# Altium project PumpSystem.PrjPCB (part 1 of 8)
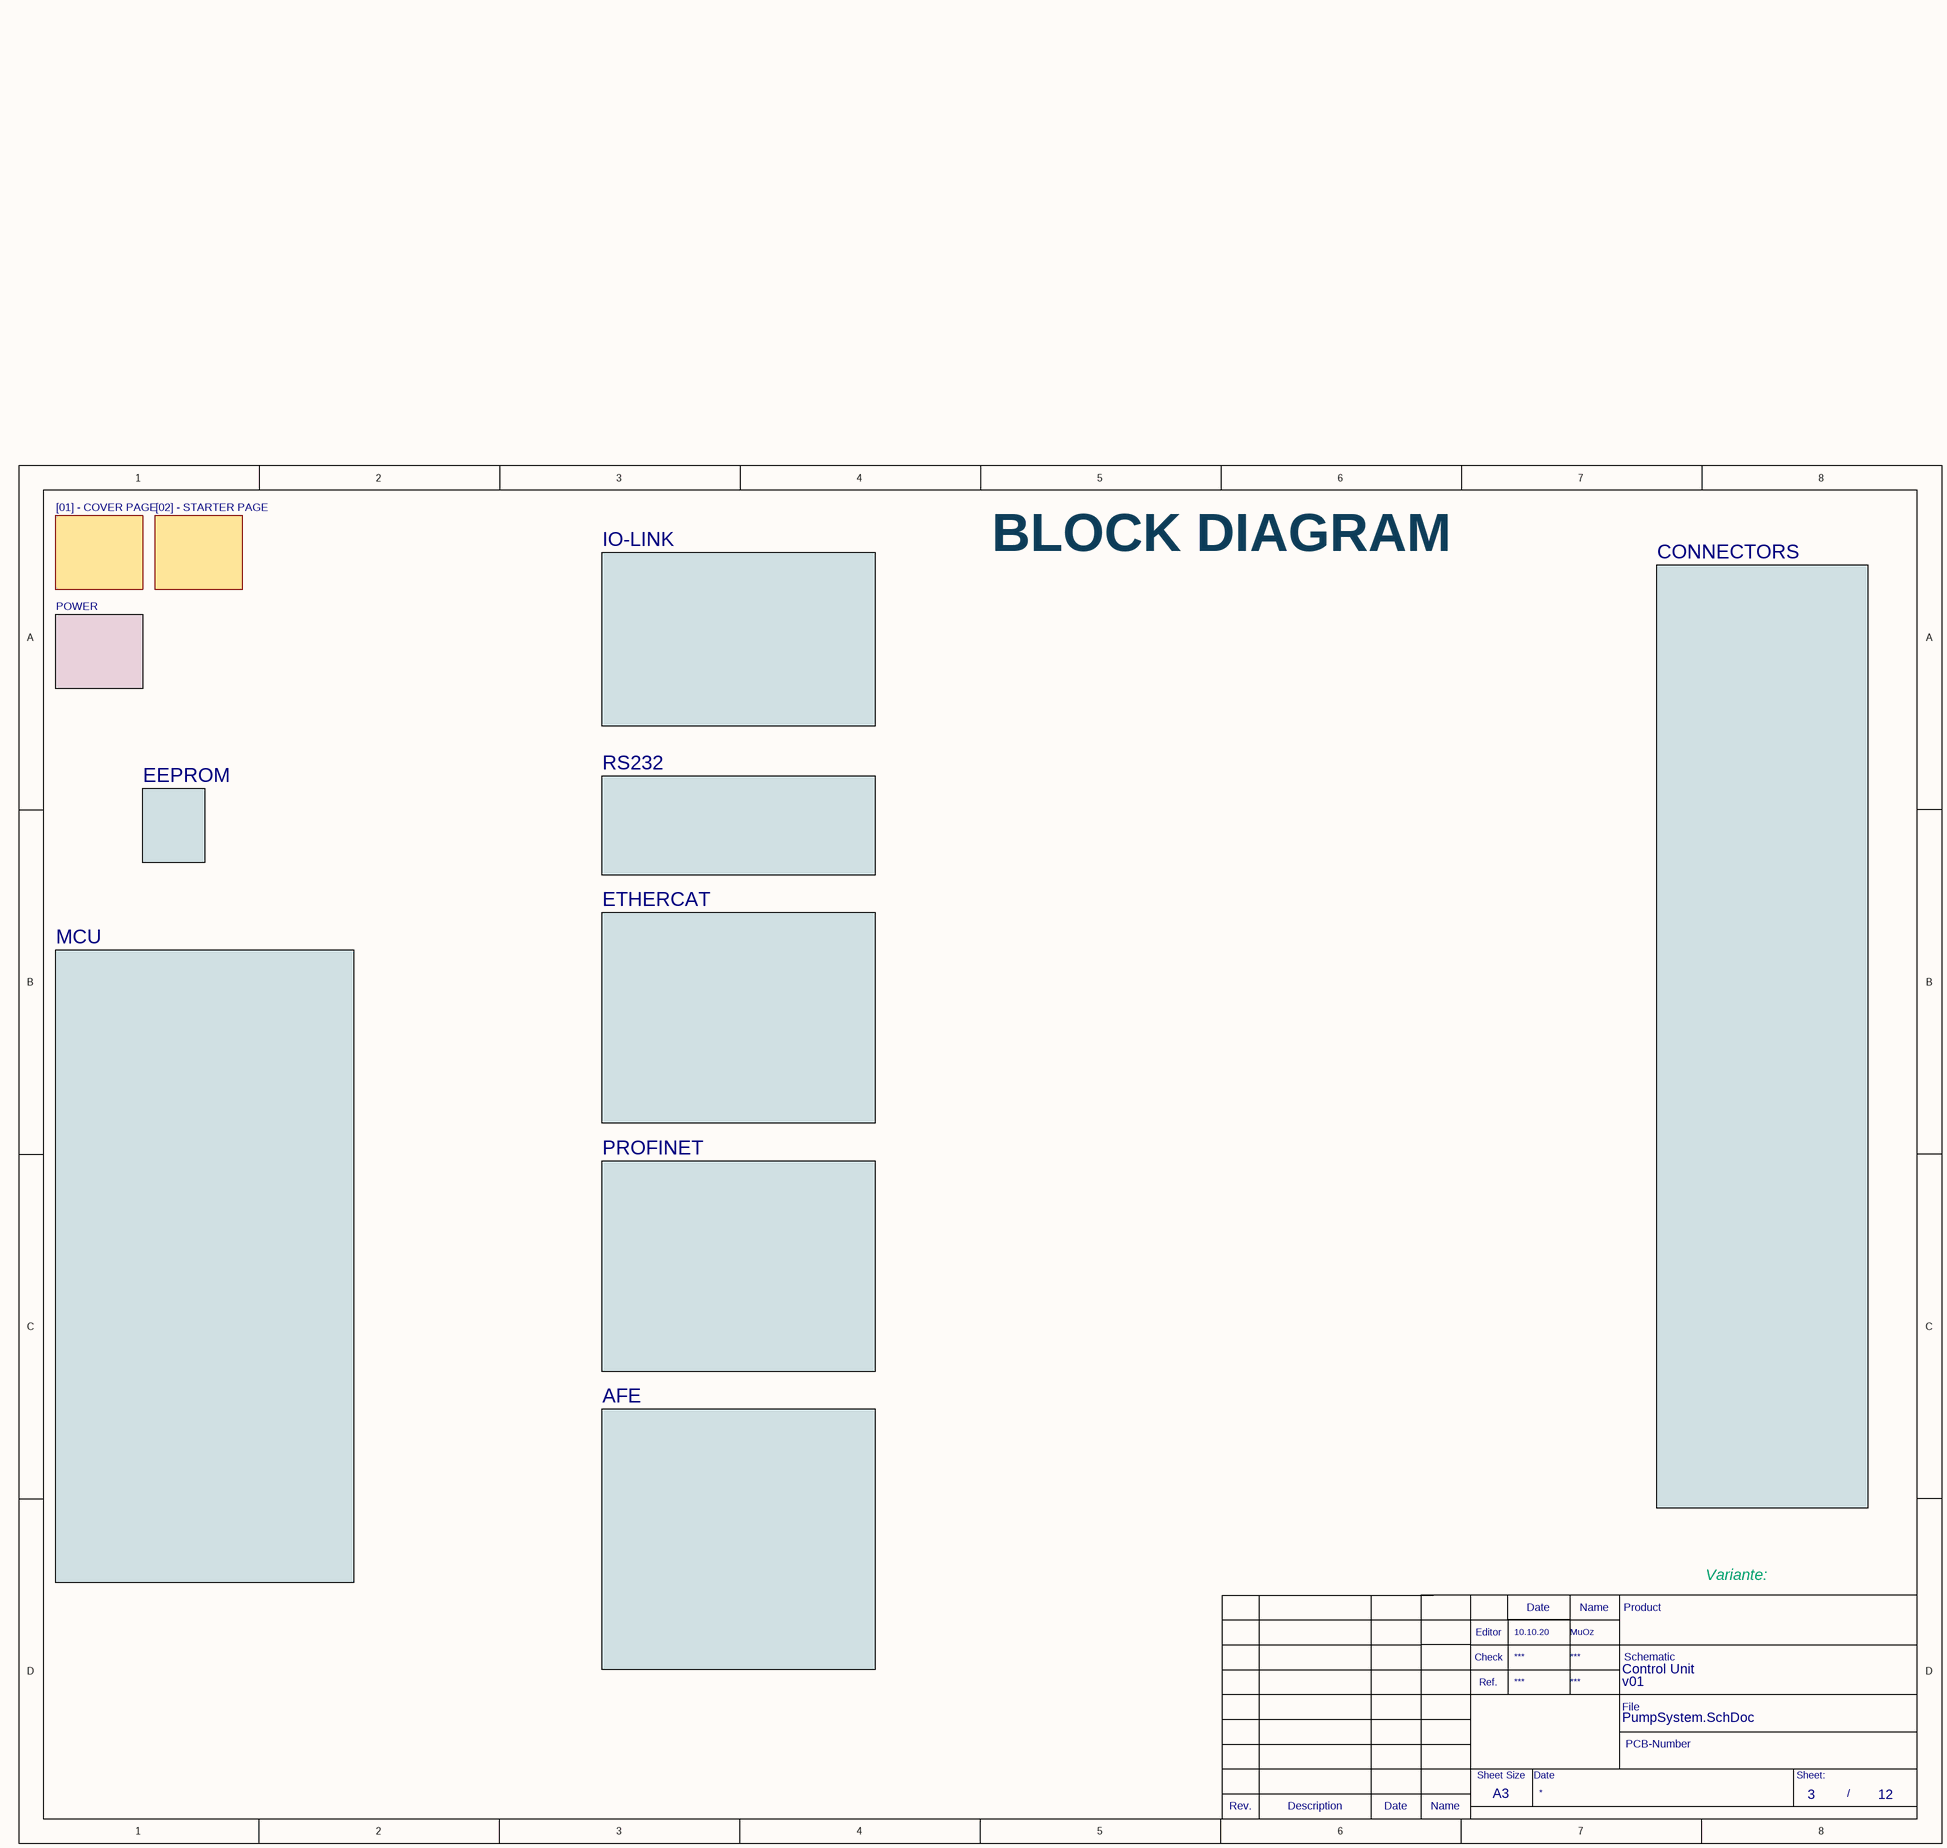
[diagram p0: PumpSystem.SchDoc]
ApprovedBy_PRO: ***; ApprovedDate_PRO: ***; Author_PRO: MuOz; CheckedBy_PRO: ***; CheckedDate_PRO: ***; Date_PRO: 10.10.20; Title1_PRO: Control Unit; Title2_PRO: v01
12 sheets, 375 parts. Net scope: flat (ports and power ports of the same name join across sheets).
Board file: PumpSystem.PcbDoc
Sheets:
  PumpSystem.SchDoc
    [01] - COVER PAGE = [01] - COVER PAGE.SchDoc
    [02] - STARTER PAGE = [02] - STARTER PAGE.SchDoc
    MCU = [03] - MCU.SchDoc
    ETHERCAT = [04] - ETHERCAT.SchDoc
    PROFINET = [05] - PROFINET.SchDoc
    POWER = [06] - POWER.SchDoc
    RS232 = [07] - RS232.SchDoc
    IO-LINK = [08] - IO-LINK.SchDoc
    AFE = [09] - AFE.SchDoc
    CONNECTORS = [10] - CONNECTORs.SchDoc
    EEPROM = [11] - EEPROM.SchDoc

## Sheet PumpSystem.SchDoc
size A3; CompanyName: FEDEVEL; Organization: FEDEVEL; DocumentNumber: 3; Revision: V1I1; SheetNumber: 3; SheetTotal: 12; PageSetup: Record=PageOptions|CenterHorizontal=True|CenterVertical=True|PrintScale=1.07|XCorrection=1.00|YCorrection=1.00|PrintKind=1|BorderSize=5000000|LeftOffset=0|BottomOffset=0|Orientation=2|PaperLength=1000|PaperWidth=1000|Scale=100|PaperSource=7|PrintQuality=600|MediaType=1|DitherType=10|PaperKind=A3|PrintScaleMode=1; ProjectName: KDS C6A816x Module

### Sub-sheets
[01] - COVER PAGE = [01] - COVER PAGE.SchDoc: no entries
[02] - STARTER PAGE = [02] - STARTER PAGE.SchDoc: no entries
AFE = [09] - AFE.SchDoc: no entries
CONNECTORS = [10] - CONNECTORs.SchDoc: no entries
EEPROM = [11] - EEPROM.SchDoc: no entries
ETHERCAT = [04] - ETHERCAT.SchDoc: no entries
IO-LINK = [08] - IO-LINK.SchDoc: no entries
MCU = [03] - MCU.SchDoc: no entries
POWER = [06] - POWER.SchDoc: no entries
PROFINET = [05] - PROFINET.SchDoc: no entries
RS232 = [07] - RS232.SchDoc: no entries

### Notes on the sheet
- BLOCK DIAGRAM
- Date
- Name
- Product
- Variante:
- Editor
- Check
- Ref.
- Schematic
- File
- PCB-Number
- Rev.
- Description
- Sheet Size
- A3
- Sheet:
- /

## Sheet [01] - COVER PAGE.SchDoc
size A3; DocumentNumber: 1; SheetNumber: 1; SheetTotal: 12
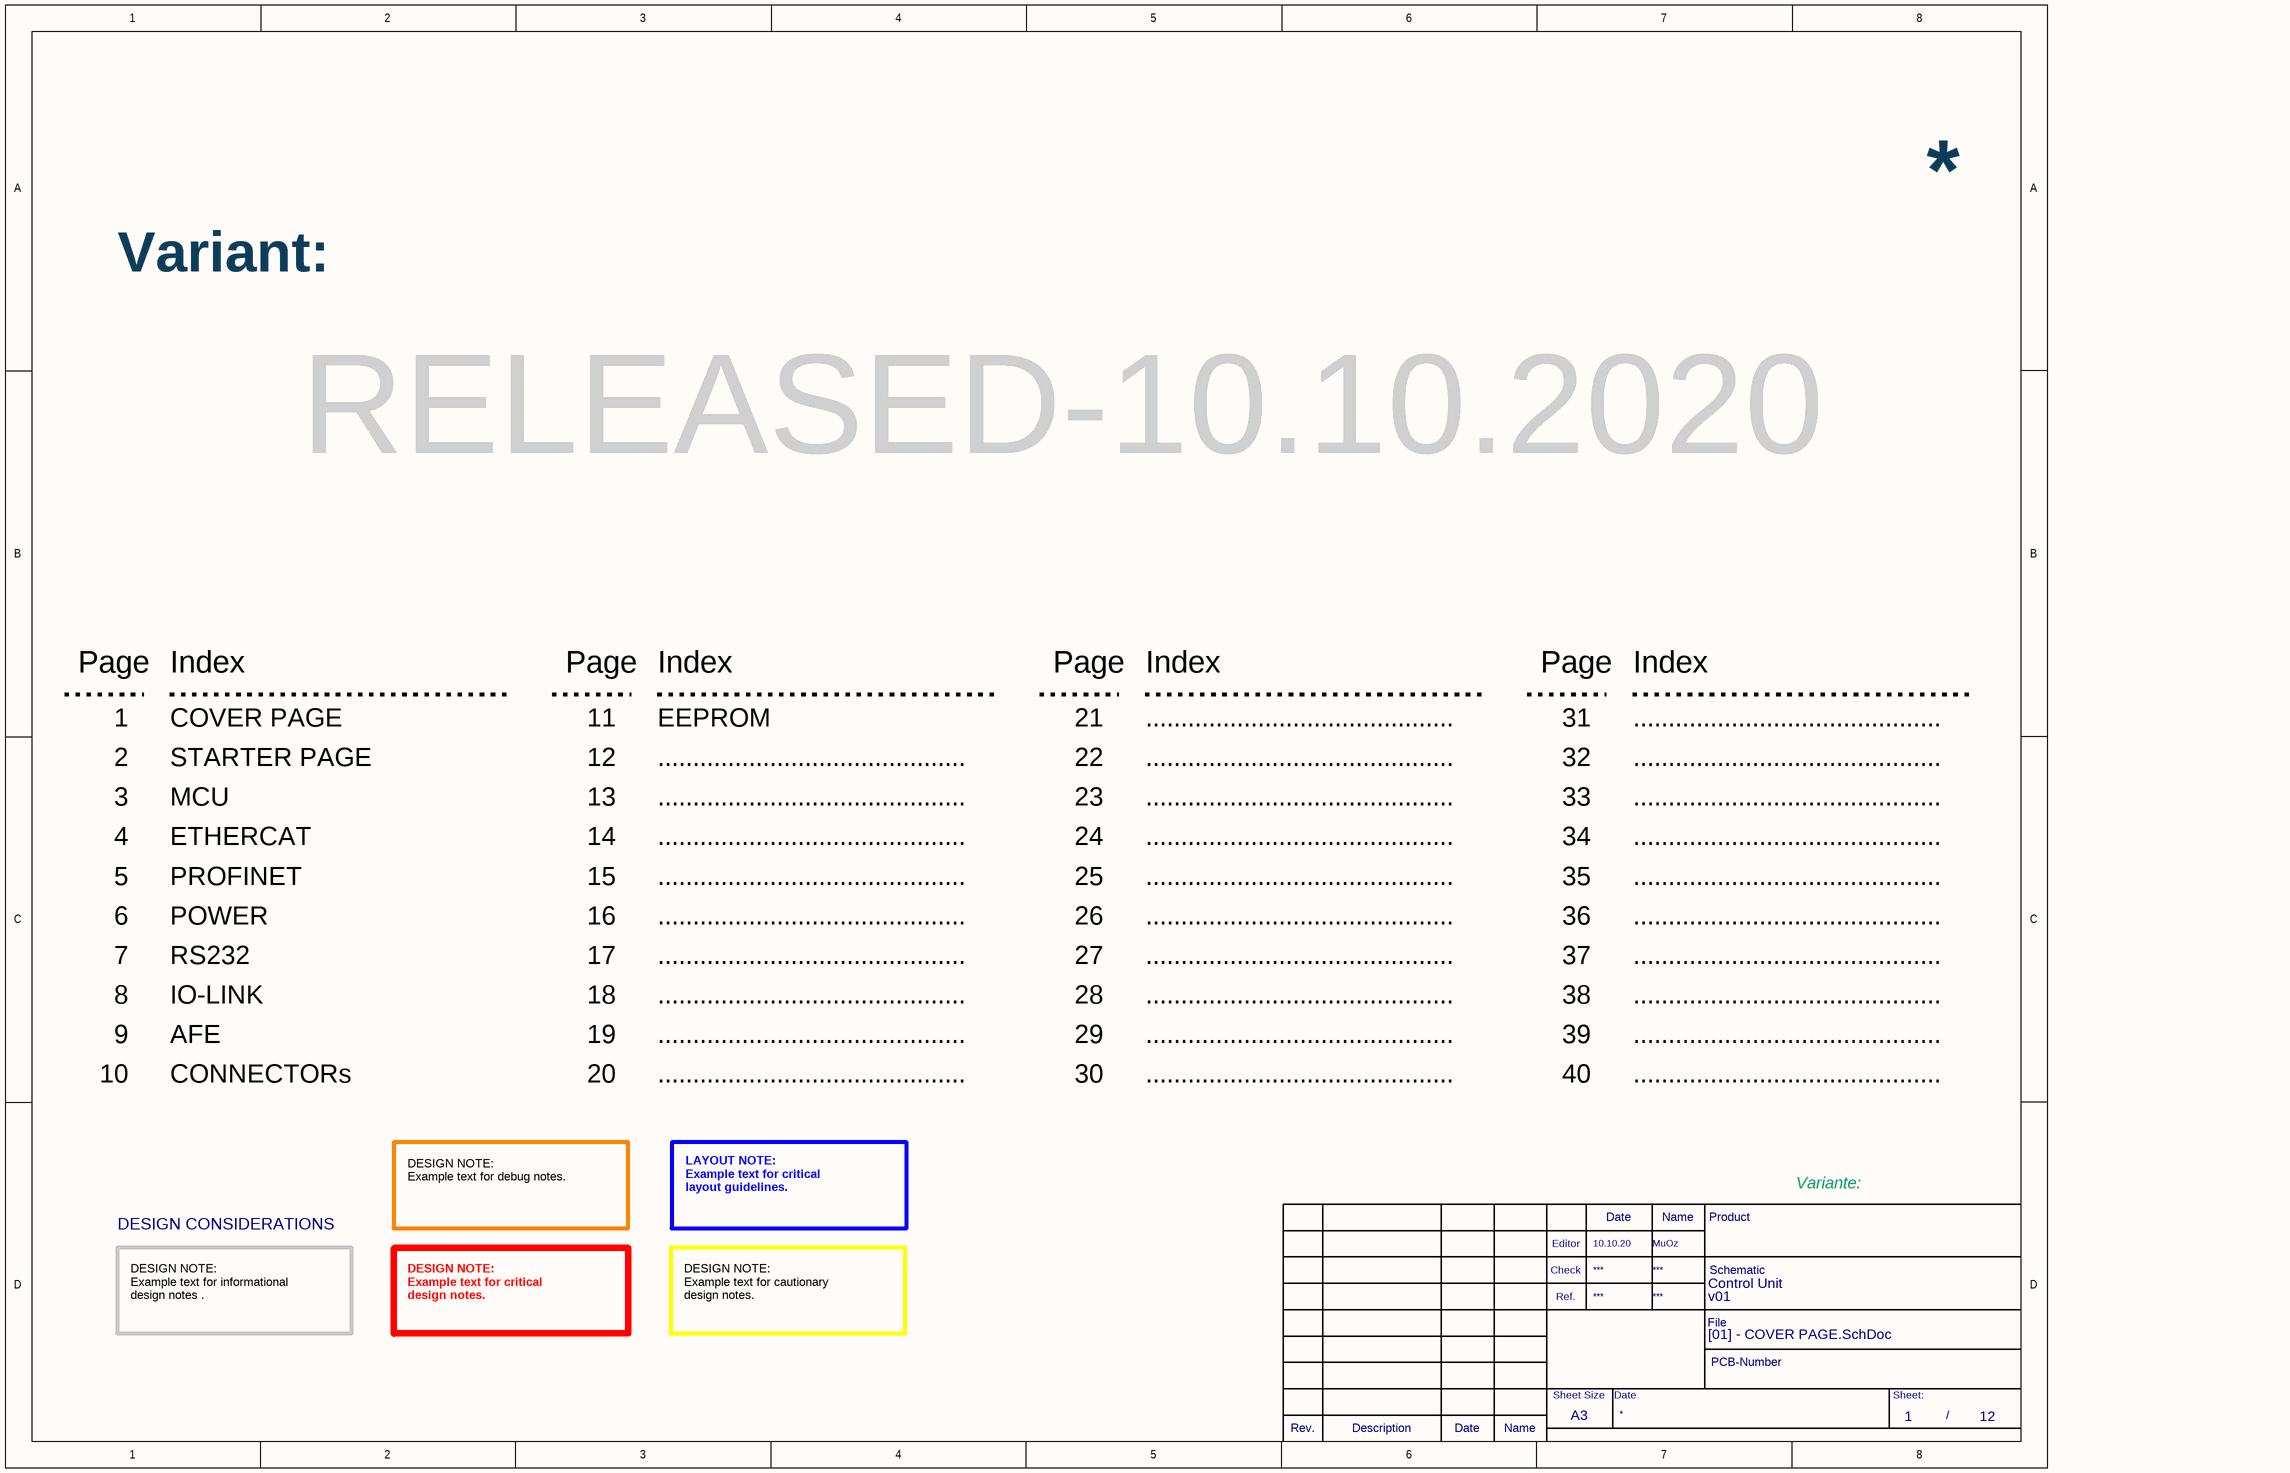
[diagram p1: [01] - COVER PAGE.SchDoc]

### Notes on the sheet
- Variant:
- RELEASED-10.10.2020
- Page
- Index
- 1
- 2
- COVER PAGE
- STARTER PAGE
- 11
- 12
- EEPROM
- ............................................
- 21
- 22
- 31
- 32
- 3
- MCU
- 13
- 23
- 33
- 4
- 5
- ETHERCAT
- PROFINET
- 14
- 15
- 24
- 25
- 34
- 35
- 6
- 7
- POWER
- RS232
- 16
- 17
- 26
- 27
- 36
- 37
- 8
- IO-LINK
- 18
- 28
- 38
- 9
- 10
- AFE
- CONNECTORs
- 19
- 20
- 29
- 30
- 39
- 40
- DESIGN CONSIDERATIONS
- DESIGN NOTE:
  Example text for debug notes.
- LAYOUT NOTE:
  Example text for critical
  layout guidelines.
- DESIGN NOTE:
  Example text for informational
  design notes .
- DESIGN NOTE:
  Example text for critical
  design notes.
- DESIGN NOTE:
  Example text for cautionary
  design notes.
- Date
- Name
- Product
- Variante:
- Editor
- Check
- Ref.
- Schematic
- File
- PCB-Number
- Rev.
- Description
- Sheet Size
- A3
- Sheet:
- /

## Sheet [02] - STARTER PAGE.SchDoc
size A3; DocumentNumber: 2; SheetNumber: 2; SheetTotal: 12
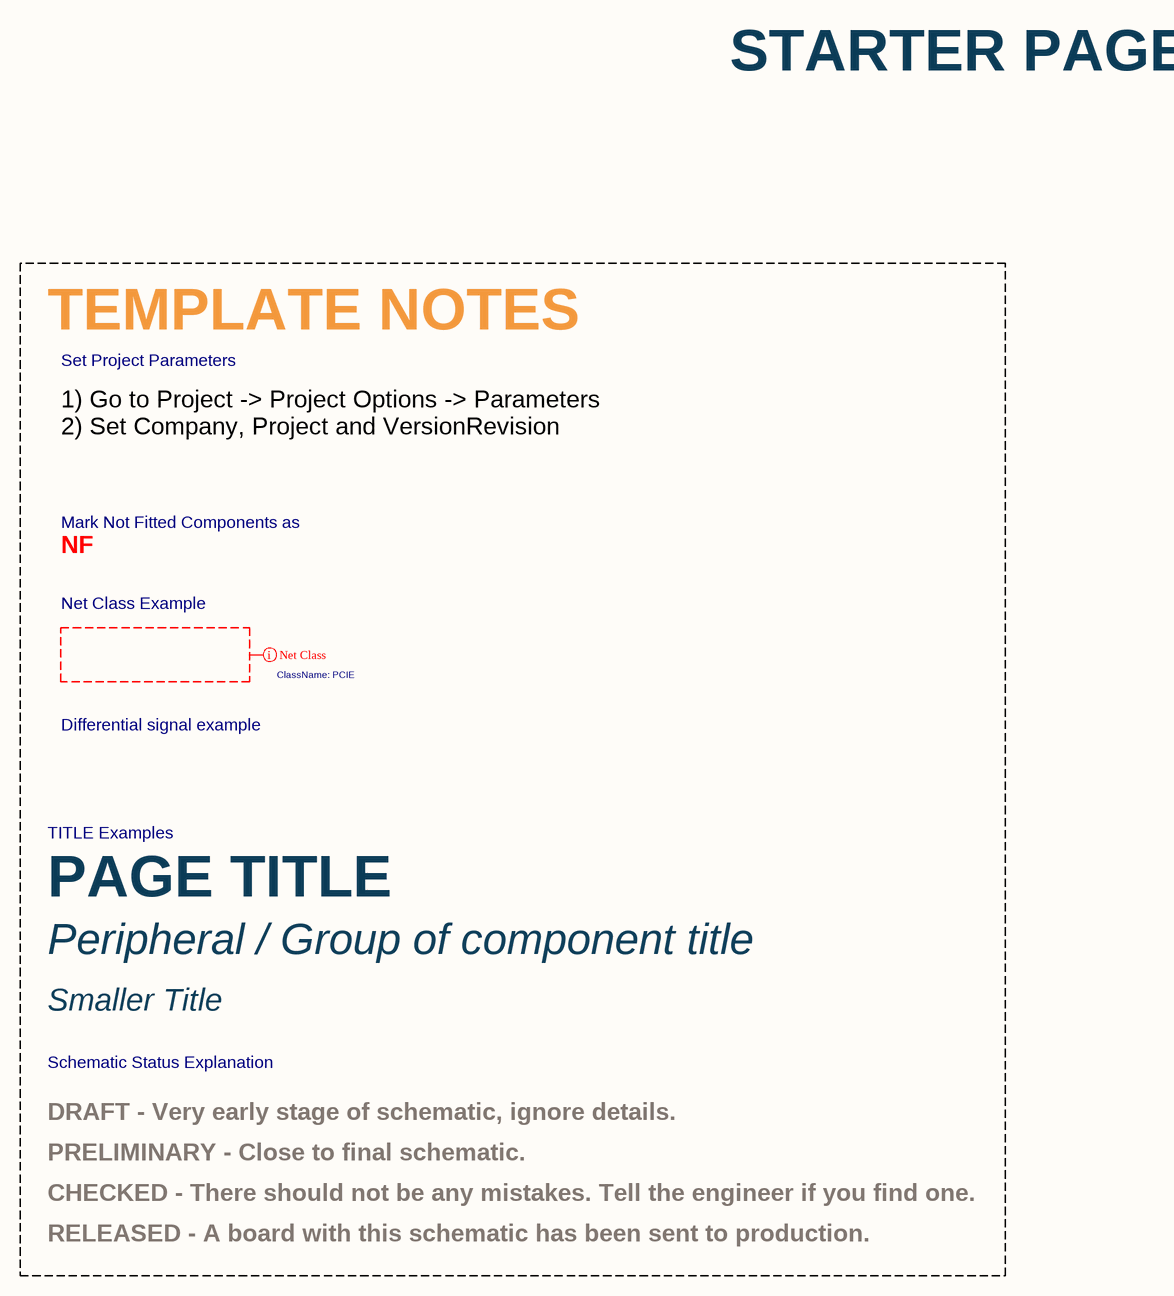
[diagram p2: [02] - STARTER PAGE.SchDoc]

### Layout directives
net class PCIE: (no net found under the mark)

### Notes on the sheet
- STARTER PAGE
- TEMPLATE NOTES
- Set Project Parameters
- 1) Go to Project -> Project Options -> Parameters
  2) Set Company, Project and VersionRevision
- NF
- Mark Not Fitted Components as
- Net Class Example
- Differential signal example
- TITLE Examples
- PAGE TITLE
- Peripheral / Group of component title
- Smaller Title
- Schematic Status Explanation
- DRAFT - Very early stage of schematic, ignore details.
- PRELIMINARY - Close to final schematic.
- RELEASED - A board with this schematic has been sent to production.
- CHECKED - There should not be any mistakes. Tell the engineer if you find one.
- Date
- Name
- Product
- Variante:
- Editor
- Check
- Ref.
- Schematic
- File
- PCB-Number
- Rev.
- Description
- Sheet Size
- A3
- Sheet:
- /

## Sheet [03] - MCU.SchDoc
size A3; DocumentNumber: 4; SheetNumber: 4; SheetTotal: 12
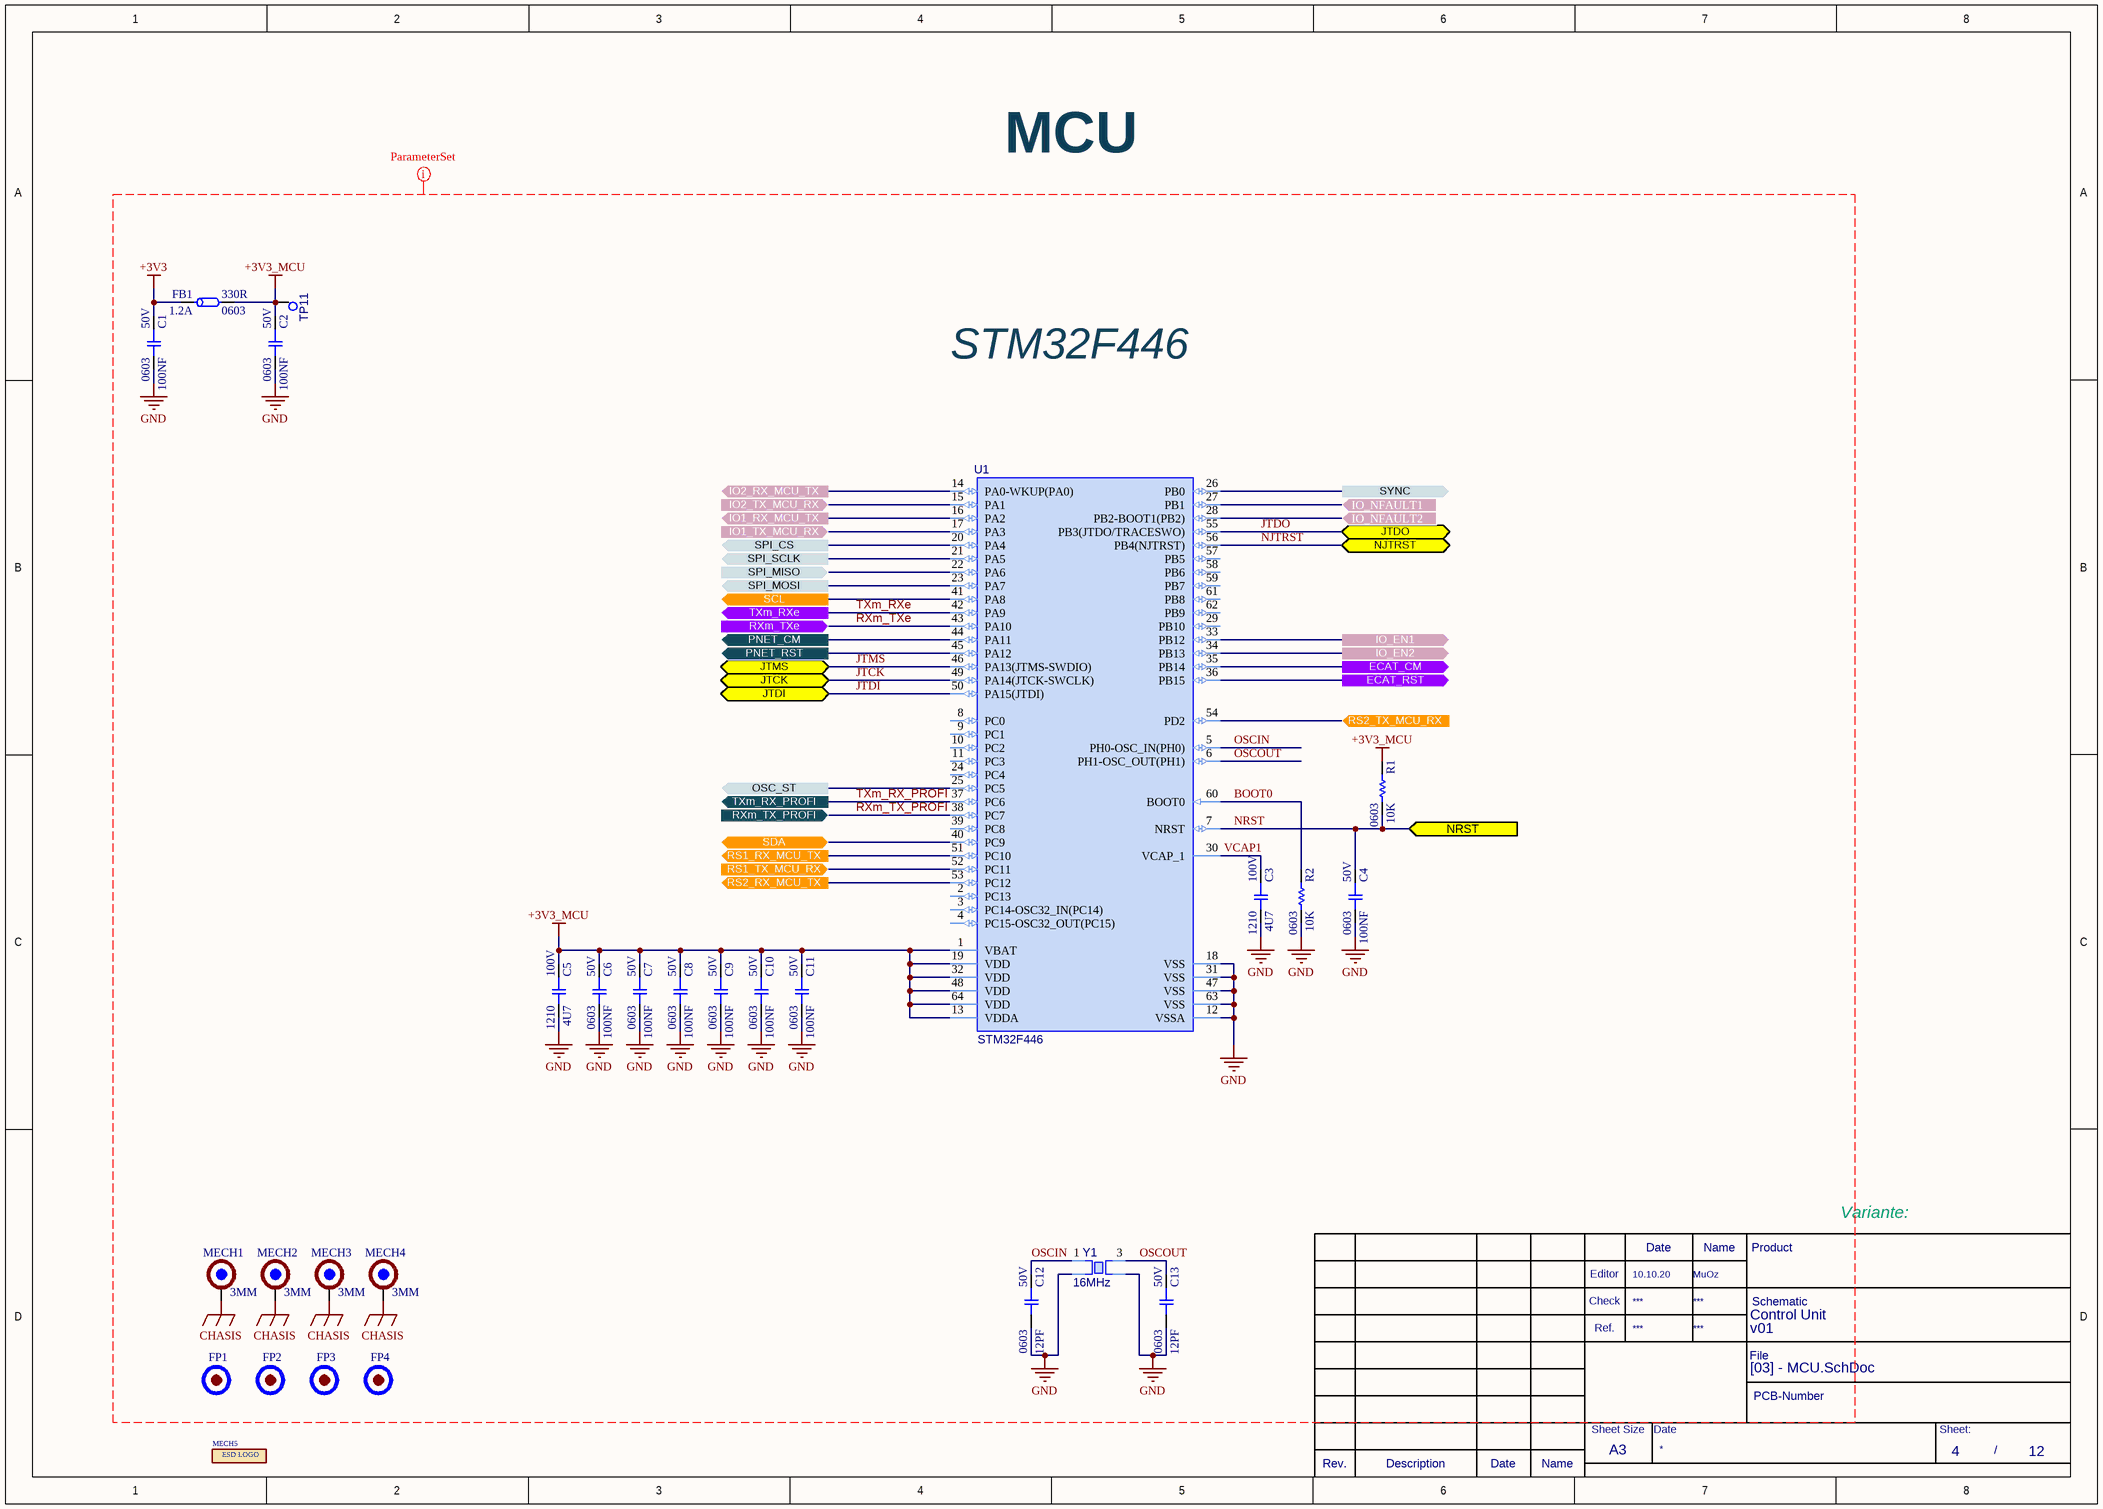
[diagram p3: [03] - MCU.SchDoc]

### Parts
C1  100NF  Voltage Rating: 50V  Case Code (Imperial): 0603  [C-0603]
C2  100NF  Voltage Rating: 50V  Case Code (Imperial): 0603  [C-0603]
C3  4U7  Case/Package: 1210  Voltage Rating: 100V  [C-1210]
C4  100NF  Voltage Rating: 50V  Case Code (Imperial): 0603  [C-0603]
C5  4U7  Case/Package: 1210  Voltage Rating: 100V  [C-1210]
C6  100NF  Voltage Rating: 50V  Case Code (Imperial): 0603  [C-0603]
C7  100NF  Voltage Rating: 50V  Case Code (Imperial): 0603  [C-0603]
C8  100NF  Voltage Rating: 50V  Case Code (Imperial): 0603  [C-0603]
C9  100NF  Voltage Rating: 50V  Case Code (Imperial): 0603  [C-0603]
C10  100NF  Voltage Rating: 50V  Case Code (Imperial): 0603  [C-0603]
C11  100NF  Voltage Rating: 50V  Case Code (Imperial): 0603  [C-0603]
C12  12PF  Case Code (Imperial): 0603  Voltage: 50V  [C-0603]
C13  12PF  Case Code (Imperial): 0603  Voltage: 50V  [C-0603]
FB1  330R  Case/Package: 0603  DC Current: 1.2A  [FB-0603]
FP1  MECH-Fiducial  [MECH-Fiducial]  (value not drawn)  (no BOM)
FP2  MECH-Fiducial  [MECH-Fiducial]  (value not drawn)  (no BOM)
FP3  MECH-Fiducial  [MECH-Fiducial]  (value not drawn)  (no BOM)
FP4  MECH-Fiducial  [MECH-Fiducial]  (value not drawn)  (no BOM)
MECH1  3MM  [MECH-3MM HOLE]  (no BOM)
MECH2  3MM  [MECH-3MM HOLE]  (no BOM)
MECH3  3MM  [MECH-3MM HOLE]  (no BOM)
MECH4  3MM  [MECH-3MM HOLE]  (no BOM)
MECH5  MECH-ESD-LOGO  [ESD_LOGO_4]  (value not drawn)  (no BOM)
R1  10K  Case Code (Imperial): 0603  [R-0603]
R2  10K  Case Code (Imperial): 0603  [R-0603]
TP11  MECH-TESTPOINT  [MECH-TESTPOINT]  (value not drawn)  (no BOM)
U1  STM32F446  [STM-LQFP64_M]
Y1  16MHz  [CRY-TSX-3225]

### Ports
ECAT_CM (out), ECAT_RST (out), IO1_RX_MCU_TX (out), IO1_TX_MCU_RX (in), IO2_RX_MCU_TX (out), IO2_TX_MCU_RX (in), IO_EN1 (out), IO_EN2 (out), IO_NFAULT1 (in), IO_NFAULT2 (in), JTCK (bidir), JTDI (bidir), JTDO (bidir), JTMS (bidir), NJTRST (bidir), NRST (in), OSC_ST (out), PNET_CM (out), PNET_RST (out), RS1_RX_MCU_TX (out), RS1_TX_MCU_RX (in), RS2_RX_MCU_TX (out), RS2_TX_MCU_RX (in), RXm_TX_PROFI (in), RXm_TXe (in), SCL (out), SDA (bidir), SPI_CS (out), SPI_MISO (in), SPI_MOSI (out), SPI_SCLK (out), SYNC (out), TXm_RX_PROFI (out), TXm_RXe (out)

### Nets
+3V3: C1.1 FB1.1
+3V3_MCU: C2.1 C5.1 C6.1 C7.1 C8.1 C9.1 C10.1 C11.1 FB1.2 R1.1 TP11.1 U1.1(VBAT) U1.13(VDDA) U1.19(VDD) U1.32(VDD) U1.48(VDD) U1.64(VDD)
CHASIS: MECH1.1 MECH2.1 MECH3.1 MECH4.1
GND: C1.2 C2.2 C3.2 C4.2 C5.2 C6.2 C7.2 C8.2 C9.2 C10.2 C11.2 C12.2 C13.2 R2.2 U1.12(VSSA) U1.18(VSS) U1.31(VSS) U1.47(VSS) U1.63(VSS) Y1.2 Y1.4
BOOT0: R2.1 U1.60(BOOT0)
ECAT_CM: U1.35(PB14) ; port ECAT_CM
ECAT_RST: U1.36(PB15) ; port ECAT_RST
IO1_RX: U1.16(PA2) ; port IO1_RX_MCU_TX
IO1_TX: U1.17(PA3) ; port IO1_TX_MCU_RX
IO2_RX: U1.14(PA0-WKUP(PA0)) ; port IO2_RX_MCU_TX
IO2_TX: U1.15(PA1) ; port IO2_TX_MCU_RX
IO_EN1: U1.33(PB12) ; port IO_EN1
IO_EN2: U1.34(PB13) ; port IO_EN2
IO_NFAULT1: U1.27(PB1) ; port IO_NFAULT1
IO_NFAULT2: U1.28(PB2-BOOT1(PB2)) ; port IO_NFAULT2
JTCK: U1.49(PA14(JTCK-SWCLK)) ; port JTCK
JTDI: U1.50(PA15(JTDI)) ; port JTDI
JTDO: U1.55(PB3(JTDO/TRACESWO)) ; port JTDO
JTMS: U1.46(PA13(JTMS-SWDIO)) ; port JTMS
NJTRST: U1.56(PB4(NJTRST)) ; port NJTRST
NRST: C4.1 R1.2 U1.7(NRST) ; port NRST
OSC_ST: U1.25(PC5) ; port OSC_ST
OSCIN: C12.1 U1.5(PH0-OSC_IN(PH0)) Y1.1
OSCOUT: C13.1 U1.6(PH1-OSC_OUT(PH1)) Y1.3
PNET_CM: U1.44(PA11) ; port PNET_CM
PNET_RST: U1.45(PA12) ; port PNET_RST
RS1_RX_MCU_TX: U1.51(PC10) ; port RS1_RX_MCU_TX
RS1_TX_MCU_RX: U1.52(PC11) ; port RS1_TX_MCU_RX
RS2_RX_MCU_TX: U1.53(PC12) ; port RS2_RX_MCU_TX
RS2_TX_MCU_RX: U1.54(PD2) ; port RS2_TX_MCU_RX
RXm_TX_PROFI: U1.38(PC7) ; port RXm_TX_PROFI
RXm_TXe: U1.43(PA10) ; port RXm_TXe
SCL: U1.41(PA8) ; port SCL
SDA: U1.40(PC9) ; port SDA
SPI_CS: U1.20(PA4) ; port SPI_CS
SPI_MISO: U1.22(PA6) ; port SPI_MISO
SPI_MOSI: U1.23(PA7) ; port SPI_MOSI
SPI_SCLK: U1.21(PA5) ; port SPI_SCLK
SYNC: U1.26(PB0) ; port SYNC
TXm_RX_PROFI: U1.37(PC6) ; port TXm_RX_PROFI
TXm_RXe: U1.42(PA9) ; port TXm_RXe
VCAP1: C3.1 U1.30(VCAP_1)

Not connected (* = marked no-connect by the designer): U1 2(PC13) 3(PC14-OSC32_IN(PC14)) 4(PC15-OSC32_OUT(PC15)) 8(PC0) 9(PC1) 10(PC2) 11(PC3) 24(PC4) 29(PB10) 39(PC8) 57(PB5) 58(PB6) 59(PB7) 61(PB8) 62(PB9)

### Layout directives
net class MCU: +3V3, +3V3_MCU, BOOT0, CHASIS, GND, JTCK, JTDI, JTDO, JTMS, NJTRST, NRST, OSCIN, OSCOUT, RXm_TX_PROFI, RXm_TXe, TXm_RX_PROFI, TXm_RXe, VCAP1

### Notes on the sheet
- MCU
- STM32F446
- Date
- Name
- Product
- Variante:
- Editor
- Check
- Ref.
- Schematic
- File
- PCB-Number
- Rev.
- Description
- Sheet Size
- A3
- Sheet:
- /
- (in symbol MECH-ESD-LOGO) ESD LOGO

### Library data of the parts
C1 C2 C4 C6-C11 = C-100NF-0603: CAP CER 0.1UF 50V X7R 0603; Manufacturer: TDK; Manufacturer Part Number: C1608X7R1H104K080AA; Tolerance: 10%; Dielectric Material: Ceramic; .PCBCHK: USED; .Creator: F:TALI; Washability: OK; Temperature Coefficient: 30ppm/°C; Mount: Surface Mount; Case/Package: 0603; Case Code (Metric): 1608; Min Operating Temperature: -55°C; Max Operating Temperature: 125°C; Package Quantity: 1; Packaging: Tape and Reel; Features: Soft Termination; Length: 1.6mm; Width: 0.8mm; Thickness: 0.037inch; Lead Free: Lead Free; Capacitance: 100nF; Supplier 1: Digi-Key; Supplier Part Number 1: 445-1314-1-ND; Stock 1: 0; Pricing 1: 1=0.1, 10=0.057, 100=0.0254, 500=0.01812, 1000=0.01423 (USD); Contact Plating: Matte,Tin; Voltage Rating (DC): 50V; Dielectric: X7R; Termination: SMD/SMT; Voltage: 50V; Height: 0.8mm; Depth: 0.8mm; REACH SVHC: No SVHC; ComponentLink1URL: http://www.mouser.com/ds/2/400/lcc_commercial_general_en-837201.pdf; ComponentLink1Description: http://www.mouser.com/ds/2/400/lcc_commercial_general_en-837201.pdf; ComponentLink2URL: https://product.tdk.com/info/en/catalog/spec/mlccspec_commercial_general_midvoltage_en.pdf; ComponentLink2Description: https://product.tdk.com/info/en/catalog/spec/mlccspec_commercial_general_midvoltage_en.pdf; Supplier 2: Digi-Key; Supplier Part Number 2: 478-3540-6-ND; Stock 2: 40000; Pricing 2: 1=0.23, 10=0.161, 100=0.0756, 500=0.05304, 1000=0.0439 (USD); Number of Pins: 2; Radiation Hardening: No; ComponentLink3URL: http://uk.rs-online.com/webdocs/13d1/0900766b813d1103.pdf; ComponentLink3Description: http://uk.rs-online.com/webdocs/13d1/0900766b813d1103.pdf; ComponentLink4URL: http://www.tdk.co.jp/tefe02/e412_c.pdf; ComponentLink4Description: http://www.tdk.co.jp/tefe02/e412_c.pdf; ComponentLink5URL: http://www.farnell.com/datasheets/2291921.pdf; ComponentLink5Description: http://www.farnell.com/datasheets/2291921.pdf; ComponentLink6URL: http://www.farnell.com/datasheets/1744655.pdf; ComponentLink6Description: http://www.farnell.com/datasheets/1744655.pdf; ComponentLink7URL: http://catalogs.avx.com/SurfaceMount.pdf; ComponentLink7Description: http://catalogs.avx.com/SurfaceMount.pdf; ComponentLink8URL: http://www.farnell.com/datasheets/630895.pdf; ComponentLink8Description: http://www.farnell.com/datasheets/630895.pdf; ComponentLink9URL: http://www.avx.com/docs/Catalogs/cx7r.pdf; ComponentLink9Description: http://www.avx.com/docs/Catalogs/cx7r.pdf; ComponentLink10URL: http://www.avx.com/docs/catalogs/cauto.pdf; ComponentLink10Description: http://www.avx.com/docs/catalogs/cauto.pdf; .SCHCHK: USED; Weight: 7.1E-05oz; Composition: Ceramic; ComponentLink11URL: https://www.verical.com/server-webapp/html/getDatasheet?partID=98691; ComponentLink11Description: https://www.verical.com/server-webapp/html/getDatasheet?partID=98691; ComponentLink12URL: https://www.avx.com/docs/Catalogs/flexiterm.pdf; ComponentLink12Description: https://www.avx.com/docs/Catalogs/flexiterm.pdf
C3 C5 = C-4U7-1210-100V: CAP CER 4.7UF 100V X7S 1210; Manufacturer: Taiyo Yuden; Manufacturer Part Number: HMK325C7475KM-PE; Tolerance: 10%; Washability: OK; .Creator: M.OZKAN; .PCBCHK: USED; Supplier 1: Digi-Key; Supplier Part Number 1: 587-HMK325C7475KM-PECT-ND; Stock 1: 0; Pricing 1: 1=1.10000, 10=0.83900, 100=0.60030, 500=0.46474 (USD); RoHS: No; Mount: Surface Mount; Min Operating Temperature: -55°C; Max Operating Temperature: 125°C; Packaging: Tape and Reel; Capacitance: 4.7uF; ComponentLink1URL: http://ds.yuden.co.jp/TYCOMPAS/ut/detail.do?productNo=HMK325C7475KM-PE&amp;fileName=HMK325C7475KM-PE_SS&amp;mode=specSheetDownload&src-supplier=Digi-Key; ComponentLink1Description: http://ds.yuden.co.jp/TYCOMPAS/ut/detail.do?productNo=HMK325C7475KM-PE&amp;fileName=HMK325C7475KM-PE_SS&amp;mode=specSheetDownload&src-supplier=Digi-Key; .SCHCHK: USED
C12 C13 = C-12PF-0603: CAP CER 12PF 50V C0G/NP0 0603; Manufacturer: Samsung; Manufacturer Part Number: CL10C120JB8NNNC; Dielectric: C0G; Material: Ceramic; Tolerance: 5%; Temperature Coefficient: 300ppm/°C; .Creator: M.OZKAN; .PCBCHK: USED; Washability: OK; Supplier 1: Digi-Key; Mount: Surface Mount; Case/Package: 0603; Case Code (Metric): 1608; Min Operating Temperature: -55°C; Max Operating Temperature: 125°C; Capacitance: 12pF; Voltage Rating: 50V; Packaging: Tape and Reel; Length: 1.6mm; Height: 0.8mm; Depth: 0.8mm; Width: 0.031inch; Thickness: 0.035inch; Radiation Hardening: No; ComponentLink1URL: https://media.digikey.com/pdf/Data%20Sheets/Samsung%20PDFs/CL_Series_MLCC_ds.pdf; ComponentLink1Description: https://media.digikey.com/pdf/Data%20Sheets/Samsung%20PDFs/CL_Series_MLCC_ds.pdf; ComponentLink2URL: https://www.verical.com/server-webapp/html/getDatasheet?partID=640658; ComponentLink2Description: https://www.verical.com/server-webapp/html/getDatasheet?partID=640658; Supplier Part Number 1: 1276-1254-6-ND; Stock 1: 259919; Pricing 1: 1=0.1, 10=0.07, 100=0.0314, 500=0.0224, 1000=0.0176 (USD); Contact Plating: Tin; Voltage Rating (DC): 50V; Package Quantity: 1; Lead Free: Lead Free; ComponentLink3URL: https://produktinfo.conrad.com/datenblaetter/450000-474999/457317-da-01-en-VS_KONDENSATOR_0603.pdf; ComponentLink3Description: https://produktinfo.conrad.com/datenblaetter/450000-474999/457317-da-01-en-VS_KONDENSATOR_0603.pdf; .SCHCHK: USED
FB1 = FB-330R-0603: FERRITE BEAD 330 OHM 0603 1LN; Manufacturer: Murata; Manufacturer Part Number: BLM18PG331SN1D; Material: Steel,Ferrite; Tolerance: 25%; DC Resistance (DCR): 150mR; Number of Lines: 1; Test Frequency: 100MHz; Shielding: Unshielded; Washability: OK; .Creator: M.OZKAN; .PCBCHK: USED; Supplier 1: Digi-Key; RoHS: Yes; Number of Pins: 2; Core Material: Ferrite; Case Code (Metric): 1608; Case Code (Imperial): 0603; Min Operating Temperature: -55°C; Max Operating Temperature: 125°C; Impedance: 330R; Package Quantity: 1; Packaging: Tape and Reel; Current Rating: 1.2A; Max Current Rating: 1.2A; Termination: SMD/SMT; Number of Circuits: 1; Length: 1.75mm; Height: 0.8mm; Width: 0.8mm; Depth: 0.95mm; Radiation Hardening: No; REACH SVHC: No SVHC; Lead Free: Lead Free; ComponentLink1URL: https://datasheet.ciiva.com/6211/enfa0003-6211710.pdf?src-supplier=Digi-Key; ComponentLink1Description: https://datasheet.ciiva.com/6211/enfa0003-6211710.pdf?src-supplier=Digi-Key; Supplier Part Number 1: 490-5222-1-ND; Max DC Current: 1.2A; .SCHCHK: USED; Stock: 106218; Pricing: 1=0.1, 10=0.076, 25=0.0684, 50=0.05, 100=0.0433, 250=0.0342, 500=0.0288, 1000=0.0243 (USD)
FP1-FP4 = MECH-Fiducial: .PCBCHK: USED; .Creator: F:TALI; Washability: OK; .SCHCHK: USED
MECH1-MECH4 = MECH-3MM HOLE: .Creator: F:TALI; .PCBCHK: USED; Washability: OK; .SCHCHK: USED
MECH5 = MECH-ESD-LOGO: .Creator: F:TALI; .PCBCHK: USED; Washability: OK; .SCHCHK: USED
R1 R2 = R-10K-0603: RES SMD 10K OHM 1% 1/10W 0603; Manufacturer: Yageo; Manufacturer Part Number: RC0603FR-0710KL; Resistance: 10kR; Temperature Coefficient: 100ppm/°C; Voltage Rating (DC): 50V; Power Rating: 100mW; Voltage Rating: 75V; .PCBCHK: USED; .Creator: F:TALI; Washability: OK; Supplier 1: Digi-Key; Supplier Part Number 1: 311-10.0KHRCT-ND; Stock 1: 37479107; Pricing 1: 1=0.1, 10=0.026, 100=0.0107, 1000=0.00478, 2500=0.00415 (USD); Case/Package: 0603; Number of Pins: 2; Weight: 7.1E-05oz; Case Code (Metric): 1608; Min Operating Temperature: -55°C; Max Operating Temperature: 155°C; Tolerance: 1%; Composition: Thick Film; Packaging: Tape and Reel; Military Standard: Not; Termination: SMD/SMT; Length: 1.6mm; Height: 0.45mm; Width: 0.8mm; Depth: 0.8mm; Lead Pitch: 0.3mm; REACH SVHC: No SVHC; Lead Free: Lead Free; ComponentLink1URL: http://www.farnell.com/datasheets/38590.pdf; ComponentLink1Description: http://www.farnell.com/datasheets/38590.pdf; ComponentLink2URL: https://www.verical.com/server-webapp/html/getDatasheet?partID=409289; ComponentLink2Description: https://www.verical.com/server-webapp/html/getDatasheet?partID=409289; ComponentLink3URL: http://www.farnell.com/datasheets/1868787.pdf; ComponentLink3Description: http://www.farnell.com/datasheets/1868787.pdf; ComponentLink4URL: http://www.farnell.com/datasheets/443971.pdf; ComponentLink4Description: http://www.farnell.com/datasheets/443971.pdf; ComponentLink5URL: http://www.farnell.com/datasheets/1738695.pdf; ComponentLink5Description: http://www.farnell.com/datasheets/1738695.pdf; Supplier 2: Digi-Key; Supplier Part Number 2: 311-10KGRDKR-ND; Stock 2: 34952003; Pricing 2: 1=0.1, 10=0.022, 100=0.0088, 1000=0.00396, 2500=0.00344 (USD); Contact Plating: Matte,Tin; Radiation Hardening: No; ComponentLink6URL: http://www.yageo.com/documents/recent/PYu-RC_Group_51_RoHS_L_9.pdf; ComponentLink6Description: http://www.yageo.com/documents/recent/PYu-RC_Group_51_RoHS_L_9.pdf; ComponentLink7URL: https://www.verical.com/server-webapp/html/getDatasheet?partID=327958; ComponentLink7Description: https://www.verical.com/server-webapp/html/getDatasheet?partID=327958; ComponentLink8URL: http://www.yageo.com/documents/recent/PYu-RC_Group_51_RoHS_L_2.pdf; ComponentLink8Description: http://www.yageo.com/documents/recent/PYu-RC_Group_51_RoHS_L_2.pdf; Mount: Surface Mount; Package Quantity: 1; Number of Terminations: 2; Max Power Dissipation: 100mW; Working Voltage: 75V; Features: Automotive AEC-Q200; ComponentLink9URL: http://www.farnell.com/datasheets/1678796.pdf; ComponentLink9Description: http://www.farnell.com/datasheets/1678796.pdf; ComponentLink10URL: http://industrial.panasonic.com/www-cgi/jvcr13pz.cgi?E+PZ+3+AOA0002+ERJ1GNJ120C+7+WW; ComponentLink10Description: http://industrial.panasonic.com/www-cgi/jvcr13pz.cgi?E+PZ+3+AOA0002+ERJ1GNJ120C+7+WW; ComponentLink11URL: http://industrial.panasonic.com/www-data/pdf/AOA0000/AOA0000CE1.pdf; ComponentLink11Description: http://industrial.panasonic.com/www-data/pdf/AOA0000/AOA0000CE1.pdf; ComponentLink12URL: http://www.jameco.com/Jameco/Products/ProdDS/2007265.pdf; ComponentLink12Description: http://www.jameco.com/Jameco/Products/ProdDS/2007265.pdf; ComponentLink13URL: https://industrial.panasonic.com/cdbs/www-data/pdf/RDA0000/AOA0000C301.pdf; ComponentLink13Description: https://industrial.panasonic.com/cdbs/www-data/pdf/RDA0000/AOA0000C301.pdf; Supplier 3: Digi-Key; Supplier Part Number 3: YAG1290DKR-ND; Stock 3: 0; Pricing 3: 1=0.1, 10=0.044, 100=0.0178, 1000=0.00798, 2500=0.00693 (USD); .SCHCHK: USED
TP11 = MECH-TESTPOINT: .PCBCHK: USED; .Creator: F:TALI; Washability: OK; .SCHCHK: USED
U1 = IC-STM32F446RCT6TR: IC MCU 32BIT 256KB FLASH 64LQFP; Manufacturer: STMicroelectronics; Interface: I2C,SPI,USB,IrDA,SD,UART,USART,EBI/EMI; Peripherals: Brown-out Detect/Reset,POR,PWM,WDT,DMA,LVD; Core Architecture: ARM; Frequency: 180MHz; Number of I/Os: 50; Oscillator Type: Internal; Supplier 1: Digi-Key; Supplier Part Number 1: 497-19357-1-ND; Manufacturer Part Number: STM32F446RCT6TR; Stock: 739; Pricing: 1=6.76, 10=6.11, 25=5.826, 100=5.0588, 250=4.8314, 500=4.4051 (USD); RoHS: No; Case/Package: LQFP; Min Operating Temperature: -40°C; Max Operating Temperature: 85°C; Memory Type: FLASH; Packaging: Tape and Reel; Memory Size: 256KB; ComponentLink1URL: http://www.st.com/content/ccc/resource/technical/document/errata_sheet/c3/6b/f8/32/fc/01/48/6e/DM00155929.pdf/files/DM00155929.pdf/jcr:content/translations/en.DM00155929.pdf?src-supplier=Digi-Key; ComponentLink1Description: http://www.st.com/content/ccc/resource/technical/document/errata_sheet/c3/6b/f8/32/fc/01/48/6e/DM00155929.pdf/files/DM00155929.pdf/jcr:content/translations/en.DM00155929.pdf?src-supplier=Digi-Key
Y1 = CRYSTAL-TSX-3225 16.0000MF18X-AC0: CRYSTAL 16.00 MHZ 9PF SMD; Manufacturer: Epson; ESR (Equivalent Series Resistance): 60R; Frequency Stability: 18ppm; Frequency Tolerance: 10ppm; Supplier 1: Digi-Key; Supplier Part Number 1: SER4070CT-ND; Manufacturer Part Number: TSX-3225 16.0000MF18X-AC0; ComponentLink1URL: https://www.eea.epson.com/wp-content/uploads/2016/11/November-2016-PCS-MASTER-BOOK.pdf?src-supplier=Verical; ComponentLink1Description: https://www.eea.epson.com/wp-content/uploads/2016/11/November-2016-PCS-MASTER-BOOK.pdf?src-supplier=Verical; Stock: 467; Pricing: 1=0.33, 10=0.275, 50=0.2476, 100=0.22, 500=0.209 (USD); RoHS: Yes; Mount: Surface Mount; Case/Package: SMD/SMT; Min Operating Temperature: -20°C; Max Operating Temperature: 75°C; Packaging: Tape and Reel; Frequency: 16MHz; Load Capacitance: 9pF; Length: 0.126inch; Width: 0.098inch; Height: 0.024inch; ComponentLink2URL: https://www5.epsondevice.com/en/information/support/pdf/june_2018_psc_masterbook.pdf?src-supplier=Digi-Key; ComponentLink2Description: https://www5.epsondevice.com/en/information/support/pdf/june_2018_psc_masterbook.pdf?src-supplier=Digi-Key; ComponentLink3URL: https://www.eea.epson.com/wp-content/uploads/2016/11/November-2016-PCS-MASTER-BOOK.pdf?src-supplier=Mouser; ComponentLink3Description: https://www.eea.epson.com/wp-content/uploads/2016/11/November-2016-PCS-MASTER-BOOK.pdf?src-supplier=Mouser; ComponentLink4URL: https://www.eea.epson.com/wp-content/uploads/2016/11/November-2016-PCS-MASTER-BOOK.pdf?src-supplier=Dove; ComponentLink4Description: https://www.eea.epson.com/wp-content/uploads/2016/11/November-2016-PCS-MASTER-BOOK.pdf?src-supplier=Dove